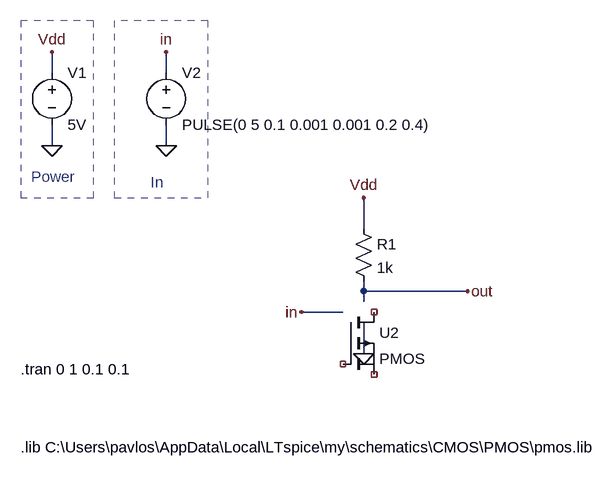
[diagram p0: schematic pmos_block.asc]
pmos_block.asc, the LTspice schematic file:
Version 4
SHEET 1 880 680
WIRE -560 -416 -560 -448
WIRE -384 -416 -384 -448
WIRE -560 -304 -560 -336
WIRE -384 -304 -384 -336
WIRE -80 -176 -80 -224
WIRE -80 -80 -80 -96
WIRE 80 -80 -80 -80
WIRE -80 -64 -80 -80
WIRE -112 -48 -176 -48
WIRE -80 16 -80 -32
FLAG 80 -80 out
FLAG -176 -48 in
FLAG -80 -224 Vdd
FLAG -80 16 0
FLAG -560 -304 0
FLAG -560 -448 Vdd
FLAG -384 -304 0
FLAG -384 -448 in
SYMBOL voltage -560 -432 R0
WINDOW 123 0 0 Left 0
WINDOW 39 0 0 Left 0
SYMATTR InstName V1
SYMATTR Value 5V
SYMBOL voltage -384 -432 R0
WINDOW 123 0 0 Left 0
WINDOW 39 0 0 Left 0
SYMATTR InstName V2
SYMATTR Value PULSE(0 5 0.1 0.001 0.001 0.2 0.4)
SYMBOL pmos -112 -48 R0
SYMATTR InstName U2
SYMBOL res -96 -192 R0
SYMATTR InstName R1
SYMATTR Value 1k
TEXT -592 -256 Left 2 ;Power
TEXT -408 -248 Left 2 ;In
TEXT -608 40 Left 2 !.tran 0 1 0.1 0.1
TEXT -608 160 Left 2 !.lib C:\\Users\\pavlos\\AppData\\Local\\LTspice\\my\\schematics\\CMOS\\PMOS\\pmos.lib
RECTANGLE Normal -496 -496 -608 -224 2
RECTANGLE Normal -320 -496 -464 -224 2

The netlist it stands for:
* pmos_block.asc
V1 Vdd 0 5V
V2 in 0 PULSE(0 5 0.1 0.001 0.001 0.2 0.4)
* U2: PMOS (symbol pmos not certain, pin order unknown); nets seen at it: 
R1 Vdd out 1k
* Power
* In
.tran 0 1 0.1 0.1
.lib C:\Users\pavlos\AppData\Local\LTspice\my\schematics\CMOS\PMOS\pmos.lib
.backanno
.end